# EasyEDA Pro project ProProject_Pet_Tracker_V2_Hardware_PRO.epro, schematic Pet_Tracker_V2_Shield_v1
Create Date: 2024-06-01; Page Name: Shield; Project Name: Pet_Tracker_V2_Hardware_PRO; Schematic Name: Pet_Tracker_V2_Shield_v1; Update Date: 2024-06-08; Drawn: Simonas; Version: V1
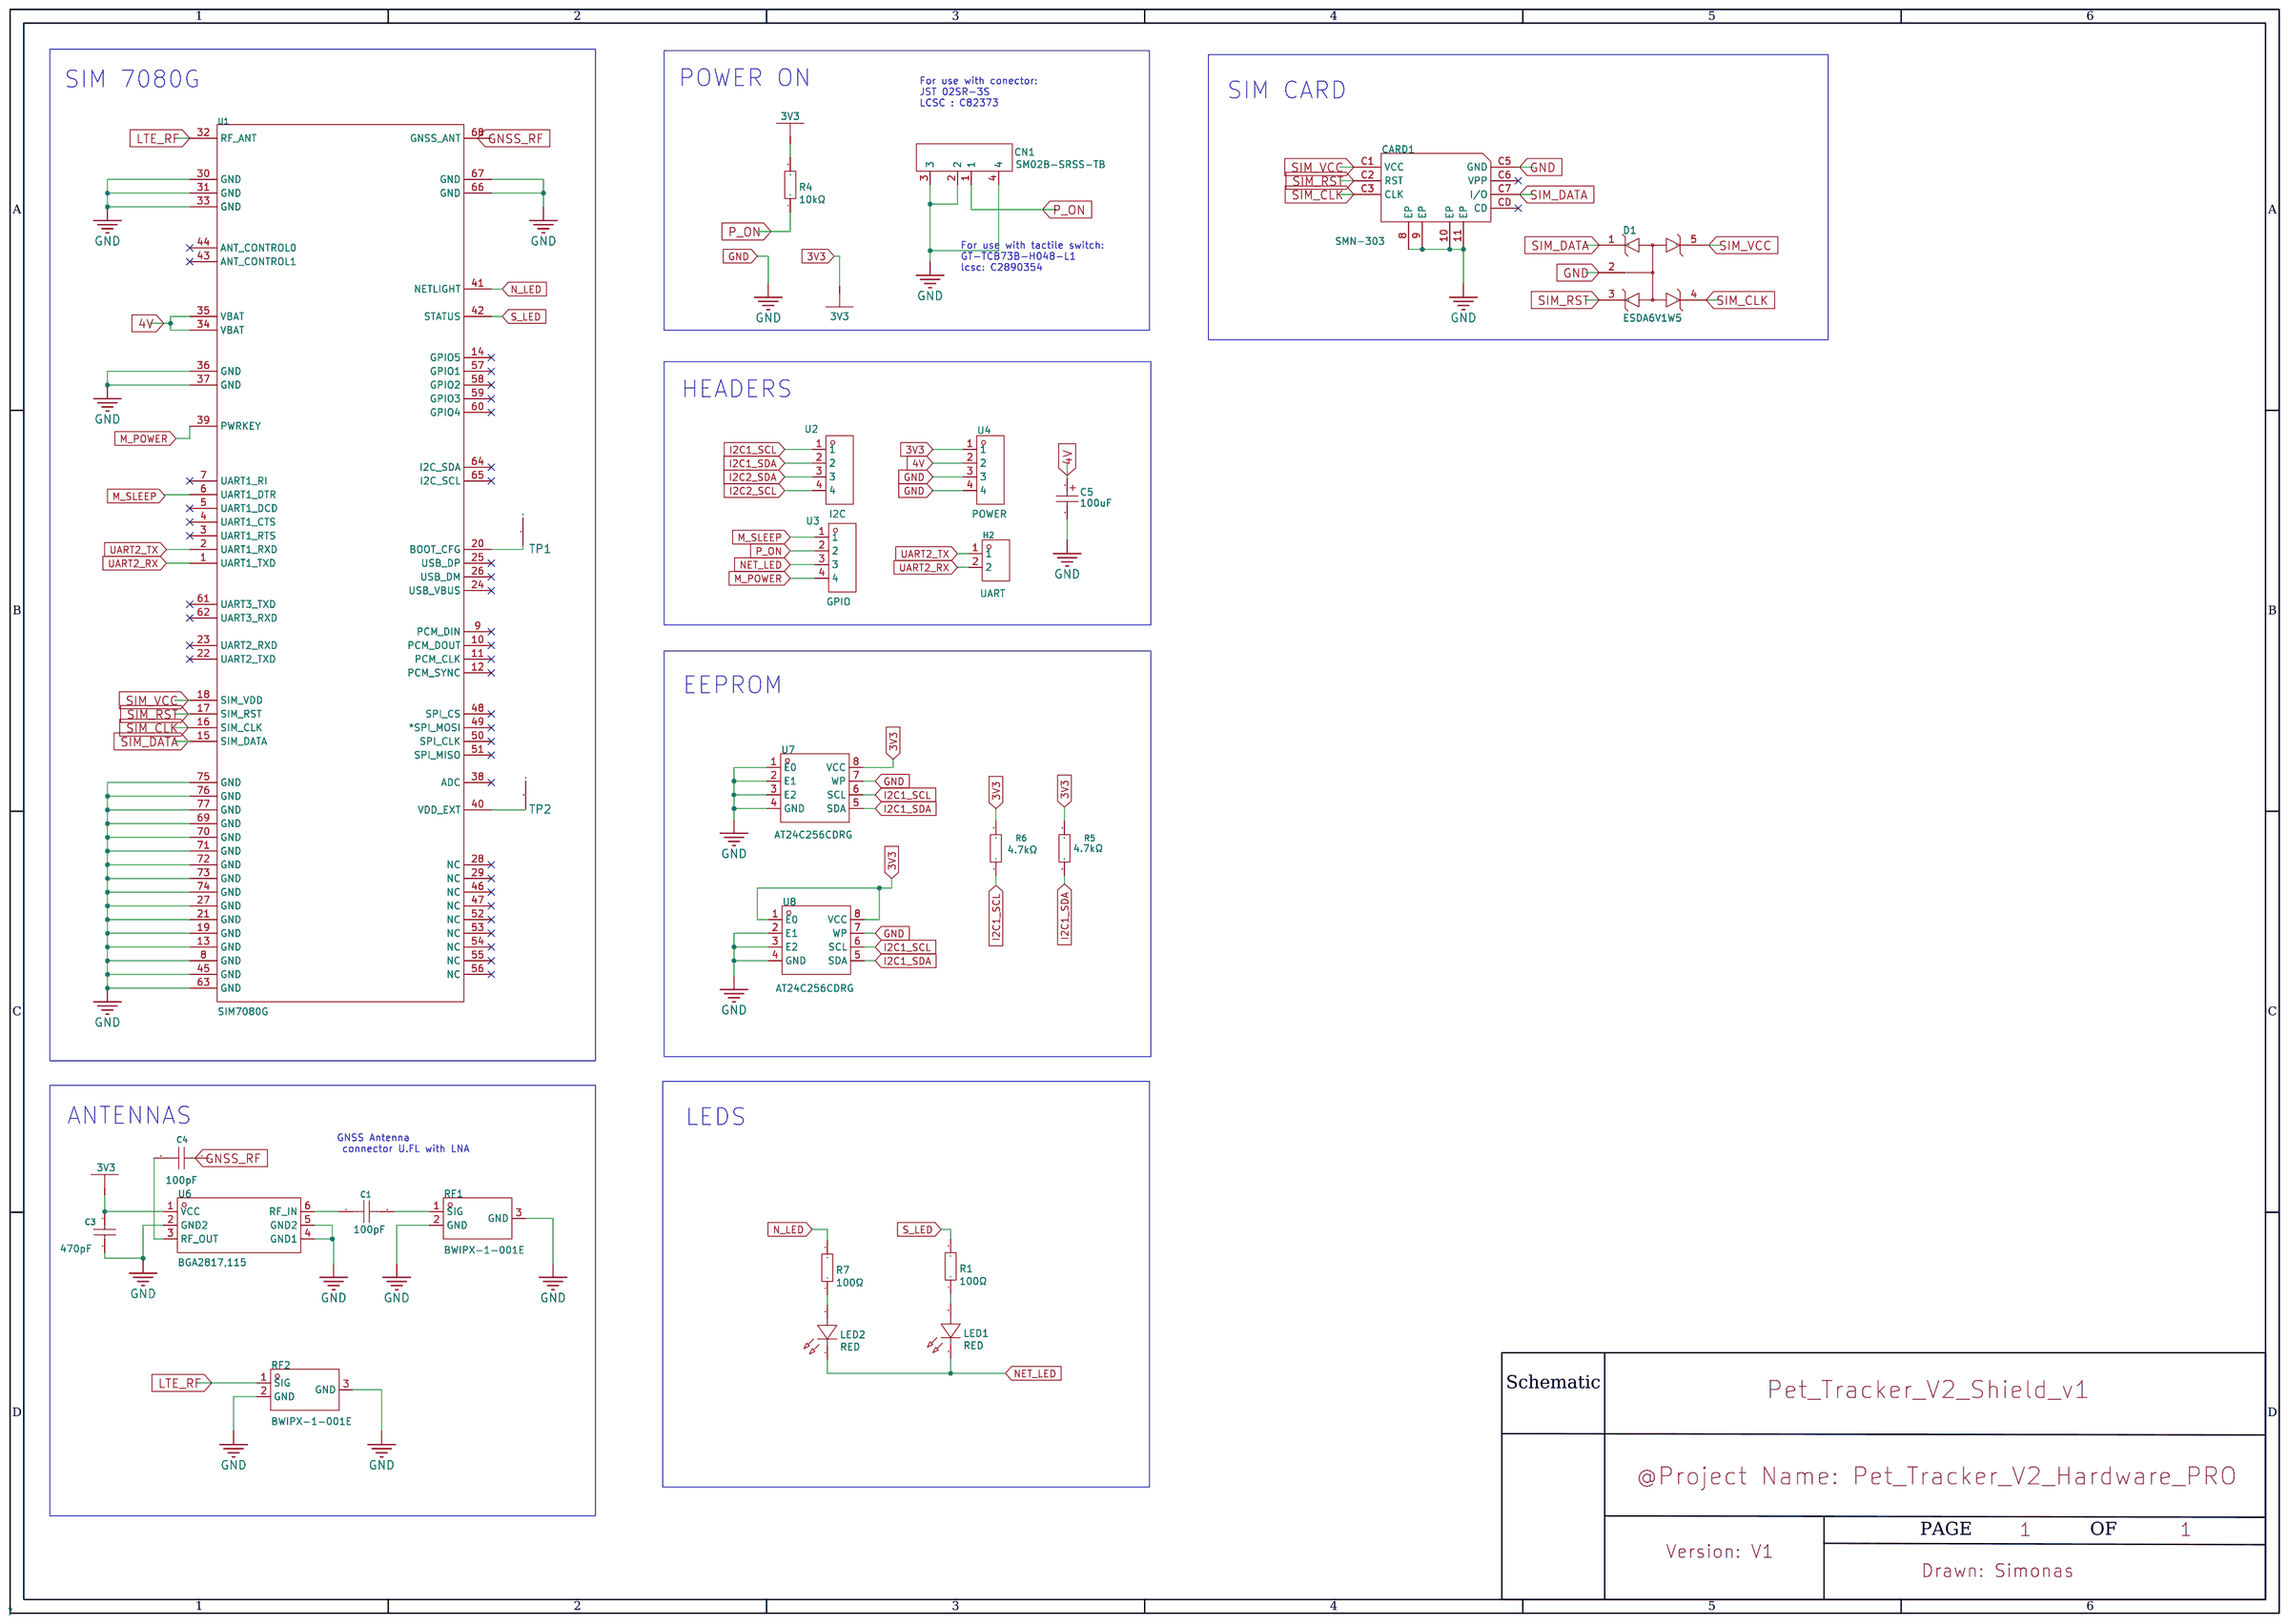
[diagram p1: schematic sheet]

## Parts
C1  100pF  [C0603]
C3  470pF  [C0603]
C4  100pF  [C0603]
C5  100uF  [CAP-SMD_L3.5-W2.8-R-RD]
CARD1  SMN-303  [SIM-SMD_SMN-303]
CN1  SM02B-SRSS-TB  [CONN-SMD_2P-P1.00_SM02B-SRSS-TB-LF-SN]
D1  ESDA6V1W5  [SC-70-5_L2.1-W1.3-P0.65-LS2.1-BR]
H2  UART  [HDR-TH_2P-P2.54-V-M]
LED1  RED  [LED0603-RD_RED]
LED2  RED  [LED0603-RD_RED]
R1  100Ω  [R0603]
R4  10kΩ  [R0603]
R5  4.7kΩ  [R0603]
R6  4.7kΩ  [R0603]
R7  100Ω  [R0603]
RF1  BWIPX-1-001E  [IPEX-SMD_BWIPX-1-001E]
RF2  BWIPX-1-001E  [IPEX-SMD_BWIPX-1-001E]
TP1  T_P  [PAD]
TP2  T_P  [PAD]
U1  SIM7080G  [LCC-SMD_SIM7080G]
U2  I2C  [HDR-TH_4P-P2.54-V-M]
U3  GPIO  [HDR-TH_4P-P2.54-V-M]
U4  POWER  [HDR-TH_4P-P2.54-V-M]
U6  BGA2817,115  [SC-70-6_L2.0-W1.3-P0.65-LS2.1-BR]
U7  AT24C256CDRG  [SOP-8_L4.9-W3.9-P1.27-LS6.0-BL]
U8  AT24C256CDRG  [SOP-8_L4.9-W3.9-P1.27-LS6.0-BL]

## Library data of the parts
C1 C4 = CC0603JRNPO9BN101: Capacitance: Tolerance:±5% Tolerance:±5% Voltage Rated: Temperature Coefficient:; LCSC Part Name: 100pF ±5% 50V; Supplier Part: C14665; Manufacturer: YAGEO(国巨); Supplier Footprint: 0603; JLCPCB Part Class: Extended Part; Datasheet: https://atta.szlcsc.com/upload/public/pdf/source/20181008/C309499_21CC21451B82C39E3D92150FD6B30293.pdf; Supplier: LCSC; Tolerance: ±5%
C3 = CC0603JRNPO9BN471: Capacitance: Tolerance:±5% Tolerance:±5% Voltage Rated: Temperature Coefficient:; LCSC Part Name: 470pF ±5% 50V; Supplier Part: C106211; Manufacturer: YAGEO(国巨); Supplier Footprint: 0603; JLCPCB Part Class: Extended Part; Datasheet: https://atta.szlcsc.com/upload/public/pdf/source/20170505/1493957838062.pdf; Supplier: LCSC; Tolerance: ±5%
C5 = CA45-B-6.3V-100uF-K: Capacitance: Tolerance:±10% Tolerance:±10% Rated Voltage: Equivalent Series Resistance(ESR):5Ω@100kHz Operating Temperature:-55℃~+125℃ Operating Temperature:-55℃~+125℃; LCSC Part Name: 100uF ±10% 6.3V; Supplier Part: C129289; Manufacturer: CEC(振华新云); Supplier Footprint: CASE-B-3528; JLCPCB Part Class: Extended Part; Datasheet: https://atta.szlcsc.com/upload/public/pdf/source/20170914/C129289_1505359937328968145.pdf; Supplier: LCSC; Tolerance: ±10%; Equivalent Series Resistance(ESR): 5Ω@100kHz; Operating Temperature: -55℃~+125℃
CARD1 = SMN-303: Card Connection Mode:Self bomb Card Type:NanoSIM卡 Connector Type:Deck Body Height (Max):1.37mm Contact Material:Phosphor coppe Contact Plating:Gold Operating Temperature Range:-40℃~+85℃ Operating Temperature Range:-40℃~+85℃ Soldering Temperature(Max):260℃; LCSC Part Name: 自弹式 NanoSIM卡 卡座; Supplier Part: C266888; Manufacturer: XUNPU(讯普); Supplier Footprint: SMD; JLCPCB Part Class: Extended Part; Datasheet: https://atta.szlcsc.com/upload/public/pdf/source/20230608/69FA23A73293DEADC31E393DD83871F4.pdf; Supplier: LCSC; Card Connection Mode: Self bomb; Card Type: NanoSIM卡; Connector Type: Deck; Body Height (Max): 1.37mm; Contact Material: Phosphor coppe; Contact Plating: Gold; Operating Temperature Range: -40℃~+85℃; Soldering Temperature(Max): 260℃; Card Detection: 有插卡检测
CN1 = SM02B-SRSS-TB(LF)(SN): Pins Structure:1x2P Pitch:1mm Mounting Style:卧贴 Reference Series:SH Number of Pins:2P Number of Rows:1 Number of PINs Per Row:2 Row Spacing:- Current Rating (Max):1A Contact Material:Copper Alloy Contact Plating:Tin Operating Temperature Range:-25℃~+85℃ O; LCSC Part Name: 1x2P 间距:1mm 卧贴 系列:SH; Supplier Part: C160402; Manufacturer: JST; Supplier Footprint: SMD,P=1mm,卧贴; JLCPCB Part Class: Extended Part; Datasheet: https://atta.szlcsc.com/upload/public/pdf/source/20181010/C265335_7D2AD766CA0E20E745663C87507A223E.pdf; Supplier: LCSC; Pins Structure: 1x2P; Pitch: 1mm; Mounting Style: 卧贴; Reference Series: SH; Number of Pins: 2P; Number of Rows: 1; Number of PINs Per Row: 2; Current Rating (Max): 1A; Contact Material: Copper Alloy; Contact Plating: Tin; Operating Temperature Range: -25℃~+85℃; Rated Voltage (Max): 50V; Plastic Material: PA; Flame Retardant Rating: UL94V-0; Z-Height of the Board: 2.9mm; X-Length of Bottom Edge on Board (Spacing Line): 4mm; Y-Width of Bottom Edge on Board: 4.32mm
D1 = ESDA6V1W5: polarity:Unidirectional Reverse Stand-Off Voltage (Vrwm):3V Maximum Clamping Voltage:6.1V Peak Pulse Power Dissipation (Ppp)@10/1000us:150W Breakdown Voltage:6.1V Number of Lines:Quad Operating Temperature:-40℃~+125℃@(Tj) Operating Temperature:-40℃~+125℃@; LCSC Part Name: 单向ESD; Supplier Part: C48677; Manufacturer: ST(意法半导体); Supplier Footprint: SOT-323-5; JLCPCB Part Class: Extended Part; Datasheet: https://atta.szlcsc.com/upload/public/pdf/source/20150504/1457707285209.pdf; Supplier: LCSC; polarity: Unidirectional; Reverse Stand-Off Voltage (Vrwm): 3V; Maximum Clamping Voltage: 6.1V; Peak Pulse Power Dissipation (Ppp)@10/1000us: 150W; Breakdown Voltage: 6.1V; Number of Lines: Quad; Operating Temperature: -40℃~+125℃@(Tj); Type: ESD
H2 = PZ254V-11-02P: Pin Structure:1x2P Pitch:2.54mm Row Spacing:- Circluar Pins/Square Pins:Square Pins Mounting Type:Straight Number of Rows:Plugin Number of Pins:2P Current Rating (Max):- Voltage Rating (Max):- Length of Mating Pin:6mm Insulation Height:2.5mm Length of End; LCSC Part Name: 间距:2.54mm 1x2P 直插 方针; Supplier Part: C492401; Manufacturer: XFCN(兴飞); Supplier Footprint: 插件,P=2.54mm; JLCPCB Part Class: Extended Part; Datasheet: https://atta.szlcsc.com/upload/public/pdf/source/20200309/C492401_A812433581A9B211A7FFA413ADDFF0E5.pdf; Supplier: LCSC; Pin Structure: 1x2P; Pitch: 2.54mm; Circluar Pins/Square Pins: Square Pins; Mounting Type: Straight; Number of Rows: Plugin; Number of Pins: 2P; Length of Mating Pin: 6mm; Insulation Height: 2.5mm; Length of End Connection Pin: 3mm; Operating Temperature Range: -40℃~+105℃; Color: Black
LED1 LED2 = RED: Supplier: LCSC; Supplier Part: C965799; Manufacturer: XINGLIGHT(成兴光); Manufacturer Part: XL-1608SURC-06; JLCPCB Part Class: Extended Part
R1 R7 = 100Ω: Supplier: LCSC; Manufacturer: YAGEO(国巨); Manufacturer Part: RC0603FR-07100RL; Supplier Part: C105588; JLCPCB Part Class: Extended Part
R4 = 10kΩ: Supplier: LCSC; Manufacturer: YAGEO(国巨); Manufacturer Part: RC0603FR-0710KL; Supplier Part: C98220; JLCPCB Part Class: Extended Part
R5 R6 = 0603WAF4701T5E: Type:Thick Film Resistors Resistance:4.7kΩ Tolerance:±1% Tolerance:±1% Power(Watts): Overload Voltage (Max): Temperature Coefficient:±100ppm/℃ Temperature Coefficient:±100ppm/℃ Operating Temperature Range:-55℃~+155℃ Operating Temperature Range:-55℃~+155℃; LCSC Part Name: 4.7kΩ ±1% 100mW 厚膜电阻; Supplier Part: C23162; Manufacturer: UNI-ROYAL(厚声); Supplier Footprint: 0603; JLCPCB Part Class: Basic Part; Datasheet: https://atta.szlcsc.com/upload/public/pdf/source/20200306/C422600_1E6D84923E4A46A82E41ADD87F860B5C.pdf; Supplier: LCSC; Type: Thick Film Resistors; Tolerance: ±1%; Temperature Coefficient: ±100ppm/℃; Operating Temperature Range: -55℃~+155℃
RF1 RF2 = BWIPX-1-001E: Connector Type:板端 Interface Type:内针 Number of Ports:1 Interface Diameter:- Interface Length/Height:- Frequency-Max:6GHz RF Series:IPEX Impedance:50Ω Style:- Operating Temperature Range:- Operating Temperature Range:-; LCSC Part Name: IPEX 内针; Supplier Part: C496552; Manufacturer: BAT WIRELESS(蝙蝠无线); Supplier Footprint: SMD; JLCPCB Part Class: Extended Part; Datasheet: https://atta.szlcsc.com/upload/public/pdf/source/20201223/C496552_05E5A9956EAE1A8819C5051D085B1DED.pdf; Supplier: LCSC; Connector Type: 板端; Interface Type: 内针; Number of Ports: 1; Frequency-Max: 6GHz; RF Series: IPEX; Impedance: 50Ω
TP1 TP2 = Pad
U1 = SIM7080G: Supplier Part: C2943992; Manufacturer: SIMCOM(芯讯通无线科技); Supplier Footprint: SMD,15.7x17.6mm; JLCPCB Part Class: Extended Part; Datasheet: https://atta.szlcsc.com/upload/public/pdf/source/20220111/4226E3CEC552F224E0C4A8D045242B11.pdf; Supplier: LCSC
U2-U4 = HB-PH3-25414PB2GOP: Pin Structure:1x4P Pitch:2.54mm Row Spacing:2.54mm Circluar Pins/Square Pins:Square Pins Mounting Type:Straight Number of Rows:Plugin Number of Pins:4P Current Rating (Max):3A Voltage Rating (Max):250V Length of Mating Pin:6mm Insulation Height:2.54mm Len; LCSC Part Name: 间距:2.54mm 1x4P 直插 方针; Supplier Part: C6332197; Manufacturer: HANBO(汉博); Supplier Footprint: 插件,P=2.54mm; JLCPCB Part Class: Extended Part; Datasheet: https://atta.szlcsc.com/upload/public/pdf/source/20230803/F72D259687963761DF1B552F3BB84A31.pdf; Supplier: LCSC; Pin Structure: 1x4P; Pitch: 2.54mm; Row Spacing: 2.54mm; Circluar Pins/Square Pins: Square Pins; Mounting Type: Straight; Number of Rows: Plugin; Number of Pins: 4P; Current Rating (Max): 3A; Voltage Rating (Max): 250V; Length of Mating Pin: 6mm; Insulation Height: 2.54mm; Length of End Connection Pin: 3mm; Contact Plating: Gold; Operating Temperature Range: -40℃~+105℃; Soldering Temperature(Max): 260℃; Color: Black
U6 = BGA2817,115: Applications:General-purpose Frequency Range:0Hz~2.2GHz Frequency Range:0Hz~2.2GHz Gain:24.4dB Noise Figure:3.8dB Supply Voltage:3V~3.6V Supply Voltage:3V~3.6V Supply Current:20mA Operating Temperature:-40℃~+85℃ Operating Temperature:-40℃~+85℃; Supplier Part: C2654187; Manufacturer: NXP(恩智浦); Supplier Footprint: TSSOP-6; JLCPCB Part Class: Extended Part; Datasheet: https://atta.szlcsc.com/upload/public/pdf/source/20211206/7C9741864C53AC912F2247D633D32FC5.pdf; Supplier: LCSC; Applications: General-purpose; Frequency Range: 0Hz~2.2GHz; Gain: 24.4dB; Noise Figure: 3.8dB; Supply Voltage: 3V~3.6V; Supply Current: 20mA; Operating Temperature: -40℃~+85℃
U7 U8 = AT24C256CDRG: Supplier Part: C19723712; Manufacturer: HGC(深圳汉芯); Supplier Footprint: SOP-8; JLCPCB Part Class: Extended Part; Datasheet: https://atta.szlcsc.com/upload/public/pdf/source/20231229/A23F57E7F9A602978E4C608447736C14.pdf; Supplier: LCSC

## Nets
3V3: C3.2 R4.2 R5.2 R6.2 U4.1 U6.1(VCC) U7.8(VCC) U8.1(E0) U8.8(VCC)
4V: C5.1 U1.34(VBAT) U1.35(VBAT) U4.2
GND: C3.1 C5.2 CARD1.8(EP) CARD1.9(EP) CARD1.10(EP) CARD1.11(EP) CARD1.C5(GND) CN1.2 CN1.3 CN1.4 D1.2 RF1.2(GND) RF1.3(GND) RF2.2(GND) RF2.3(GND) U1.8(GND) U1.13(GND) U1.19(GND) U1.21(GND) U1.27(GND) U1.30(GND) U1.31(GND) U1.33(GND) U1.36(GND) U1.37(GND) U1.45(GND) U1.63(GND) U1.66(GND) U1.67(GND) U1.69(GND) U1.70(GND) U1.71(GND) U1.72(GND) U1.73(GND) U1.74(GND) U1.75(GND) U1.76(GND) U1.77(GND) U4.3 U4.4 U6.2(GND2) U6.4(GND1) U6.5(GND2) U7.1(E0) U7.2(E1) U7.3(E2) U7.4(GND) U7.7(WP) U8.2(E1) U8.3(E2) U8.4(GND) U8.7(WP)
GNSS_RF: C4.1 U1.68(GNSS_ANT)
I2C1_SCL: R6.1 U2.1 U7.6(SCL) U8.6(SCL)
I2C1_SDA: R5.1 U2.2 U7.5(SDA) U8.5(SDA)
I2C2_SCL: U2.4
I2C2_SDA: U2.3
LTE_RF: RF2.1(SIG) U1.32(RF_ANT)
M_POWER: U1.39(PWRKEY) U3.4
M_SLEEP: U1.6(UART1_DTR) U3.1
N_LED: R7.2 U1.41(NETLIGHT)
NET_LED: LED1.1(K) LED2.1(K) U3.3
P_ON: CN1.1 R4.1 U3.2
S_LED: R1.2 U1.42(STATUS)
SIM_CLK: CARD1.C3(CLK) D1.4 U1.16(SIM_CLK)
SIM_DATA: CARD1.C7(I/O) D1.1 U1.15(SIM_DATA)
SIM_RST: CARD1.C2(RST) D1.3 U1.17(SIM_RST)
SIM_VCC: CARD1.C1(VCC) D1.5 U1.18(SIM_VDD)
UART2_RX: H2.2 U1.1(UART1_TXD)
UART2_TX: H2.1 U1.2(UART1_RXD)
$C1_1: C1.1 U6.6(RF_IN)
$C4_2: C4.2 U6.3(RF_OUT)
$LED1_2: LED1.2(A) R1.1
$LED2_2: LED2.2(A) R7.1
$TP1_1: TP1.1(Pin) U1.20(BOOT_CFG)
$TP2_1: TP2.1(Pin) U1.40(VDD_EXT)
Net-(C1-2): C1.2 RF1.1(SIG)

Not connected (* = marked no-connect by the designer): CARD1 C6(VPP)* CD*; U1 3(UART1_RTS)* 4(UART1_CTS)* 5(UART1_DCD)* 7(UART1_RI)* 9(PCM_DIN)* 10(PCM_DOUT)* 11(PCM_CLK)* 12(PCM_SYNC)* 14(GPIO5)* 22(UART2_TXD)* 23(UART2_RXD)* 24(USB_VBUS)* 25(USB_DP)* 26(USB_DM)* 28(NC)* 29(NC)* 38(ADC)* 43(ANT_CONTROL1)* 44(ANT_CONTROL0)* 46(NC)* 47(NC)* 48(SPI_CS)* 49(*SPI_MOSI)* 50(SPI_CLK)* 51(SPI_MISO)* 52(NC)* 53(NC)* 54(NC)* 55(NC)* 56(NC)* 57(GPIO1)* 58(GPIO2)* 59(GPIO3)* 60(GPIO4)* 61(UART3_TXD)* 62(UART3_RXD)* 64(I2C_SDA)* 65(I2C_SCL)*

## Notes on the sheet
- SIM 7080G
- POWER ON
- For use with conector:
  JST 02SR-3S
  LCSC : C82373
- SIM CARD
- For use with tactile switch:
  GT-TCB73B-H048-L1
  lcsc: C2890354
- HEADERS
- EEPROM
- ANTENNAS
- LEDS
- GNSS Antenna
   connector U.FL with LNA
